# EAGLE schematic RK05ex6x10 (EAGLE 6.6.0)

## Sheet 1 of 5
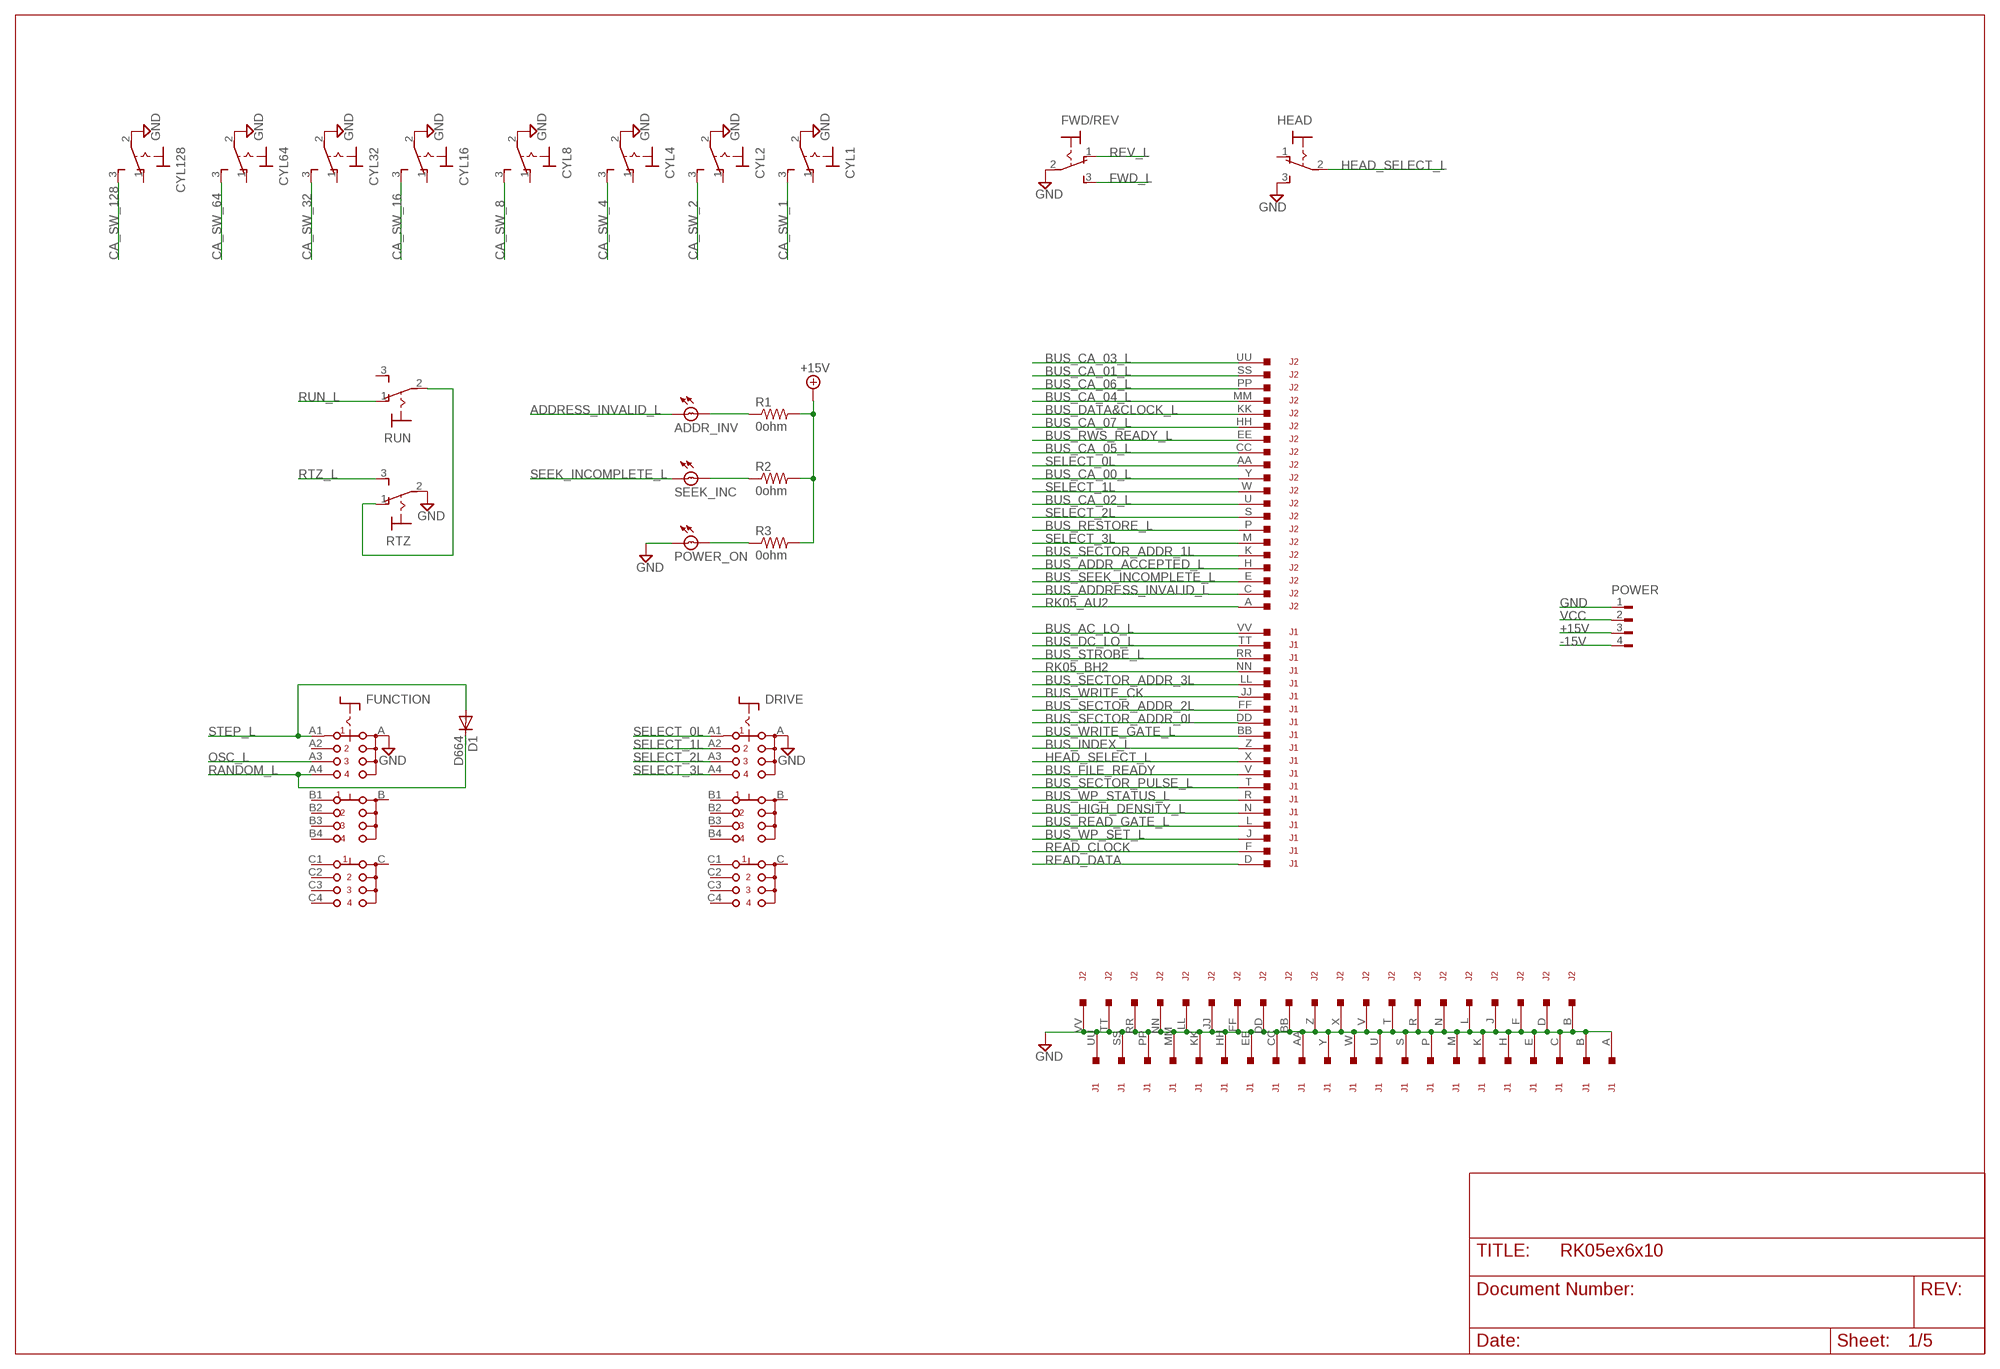
[diagram p0: schematic, sheet 1]

### Parts
ADDR_INV  BULB  [BULB]
CYL1  M9040P  [M9040P]
CYL2  M9040P  [M9040P]
CYL4  M9040P  [M9040P]
CYL8  M9040P  [M9040P]
CYL16  M9040P  [M9040P]
CYL32  M9040P  [M9040P]
CYL64  M9040P  [M9040P]
CYL128  M9040P  [M9040P]
D1  D664  1N4148DO35-10  [DO35-10]
DRIVE  CK103X04  [CK103X04]
FUNCTION  CK103X04  [CK103X04]
FWD/REV  M9040P  [M9040P]
HEAD  M9040P  [M9040P]
J1  DEC40PINSV  [DEC40PINV]
J2  DEC40PINSV  [DEC40PINV]
POWER  FLOPPY-4  [FLOPPY-4]
POWER_ON  BULB  [BULB]
R1  0ohm  R-US_0207/10  [0207/10]
R2  0ohm  R-US_0207/10  [0207/10]
R3  0ohm  R-US_0207/10  [0207/10]
RTZ  M9040P  [M9040P]
RUN  M9040P  [M9040P]
SEEK_INC  BULB  [BULB]

### Nets
+15V: POWER.3 R1.2 R2.2 R3.2 ; also sheet 3
-15V: POWER.4 ; also sheet 3
ADDRESS_INVALID_L: ADDR_INV.B ; also sheet 3
BUS_AC_LO_L: J1.VV ; also sheet 5
BUS_ADDR_ACCEPTED_L: J2.H ; also sheet 5
BUS_ADDRESS_INVALID_L: J2.C ; also sheet 3,5
BUS_CA_00_L: J2.Y ; also sheet 4,5
BUS_CA_01_L: J2.SS ; also sheet 4,5
BUS_CA_02_L: J2.U ; also sheet 4,5
BUS_CA_03_L: J2.UU ; also sheet 4,5
BUS_CA_04_L: J2.MM ; also sheet 4,5
BUS_CA_05_L: J2.CC ; also sheet 4,5
BUS_CA_06_L: J2.PP ; also sheet 4,5
BUS_CA_07_L: J2.HH ; also sheet 4,5
BUS_DATA&CLOCK_L: J2.KK ; also sheet 2,5
BUS_DC_LO_L: J1.TT ; also sheet 5
BUS_FILE_READY: J1.V ; also sheet 5
BUS_HIGH_DENSITY_L: J1.N ; also sheet 5
BUS_INDEX_L: J1.Z ; also sheet 2,5
BUS_READ_GATE_L: J1.L ; also sheet 5
BUS_RESTORE_L: J2.P ; also sheet 3,5
BUS_RWS_READY_L: J2.EE ; also sheet 3,5
BUS_SECTOR_ADDR_0L: J1.DD ; also sheet 2,5
BUS_SECTOR_ADDR_1L: J2.K ; also sheet 2,5
BUS_SECTOR_ADDR_2L: J1.FF ; also sheet 2,5
BUS_SECTOR_ADDR_3L: J1.LL ; also sheet 2,5
BUS_SECTOR_PULSE_L: J1.T ; also sheet 5
BUS_SEEK_INCOMPLETE_L: J2.E ; also sheet 3,5
BUS_STROBE_L: J1.RR ; also sheet 3,5
BUS_WP_SET_L: J1.J ; also sheet 5
BUS_WP_STATUS_L: J1.R ; also sheet 5
BUS_WRITE_CK: J1.JJ ; also sheet 5
BUS_WRITE_GATE_L: J1.BB ; also sheet 2,5
CA_SW_1: CYL1.3(S) ; also sheet 4
CA_SW_2: CYL2.3(S) ; also sheet 4
CA_SW_4: CYL4.3(S) ; also sheet 4
CA_SW_8: CYL8.3(S) ; also sheet 4
CA_SW_16: CYL16.3(S) ; also sheet 4
CA_SW_32: CYL32.3(S) ; also sheet 4
CA_SW_64: CYL64.3(S) ; also sheet 4
CA_SW_128: CYL128.3(S) ; also sheet 4
FWD_L: FWD/REV.3(S) ; also sheet 3
GND: CYL1.2(P) CYL2.2(P) CYL4.2(P) CYL8.2(P) CYL16.2(P) CYL32.2(P) CYL64.2(P) CYL128.2(P) DRIVE.A FUNCTION.A FWD/REV.2(P) HEAD.3(S) J1.A J1.AA J1.B J1.C J1.CC J1.E J1.EE J1.H J1.HH J1.K J1.KK J1.M J1.MM J1.P J1.PP J1.S J1.SS J1.U J1.UU J1.W J1.Y J2.B J2.BB J2.D J2.DD J2.F J2.FF J2.J J2.JJ J2.L J2.LL J2.N J2.NN J2.R J2.RR J2.T J2.TT J2.V J2.VV J2.X J2.Z POWER.1 POWER_ON.B RTZ.2(P) ; also sheet 2,3,4,5
HEAD_SELECT_L: HEAD.2(P) J1.X ; also sheet 5
N$30: RTZ.1(O) RUN.2(P)
N$37: ADDR_INV.A R1.1
N$38: R2.1 SEEK_INC.A
N$39: POWER_ON.A R3.1
OSC_L: FUNCTION.A3 ; also sheet 3
RANDOM_L: D1.C FUNCTION.A4 ; also sheet 3
READ_CLOCK: J1.F ; also sheet 5
READ_DATA: J1.D ; also sheet 5
REV_L: FWD/REV.1(O) ; also sheet 3
RK05_AU2: J2.A ; also sheet 5
RK05_BH2: J1.NN ; also sheet 5
RTZ_L: RTZ.3(S) ; also sheet 3
RUN_L: RUN.1(O) ; also sheet 3
SEEK_INCOMPLETE_L: SEEK_INC.B ; also sheet 3
SELECT_0L: DRIVE.A1 J2.AA ; also sheet 5
SELECT_1L: DRIVE.A2 J2.W ; also sheet 5
SELECT_2L: DRIVE.A3 J2.S ; also sheet 5
SELECT_3L: DRIVE.A4 J2.M ; also sheet 5
STEP_L: D1.A FUNCTION.A1 ; also sheet 3
VCC: POWER.2 ; also sheet 2,3,4,5
Unconnected: CYL1.1(O) CYL2.1(O) CYL4.1(O) CYL8.1(O) CYL16.1(O) CYL32.1(O) CYL64.1(O) CYL128.1(O) DRIVE.B DRIVE.B1 DRIVE.B2 DRIVE.B3 DRIVE.B4 DRIVE.C DRIVE.C1 DRIVE.C2 DRIVE.C3 DRIVE.C4 FUNCTION.A2 FUNCTION.B FUNCTION.B1 FUNCTION.B2 FUNCTION.B3 FUNCTION.B4 FUNCTION.C FUNCTION.C1 FUNCTION.C2 FUNCTION.C3 FUNCTION.C4 HEAD.1(O) RUN.3(S)

## Sheet 2 of 5
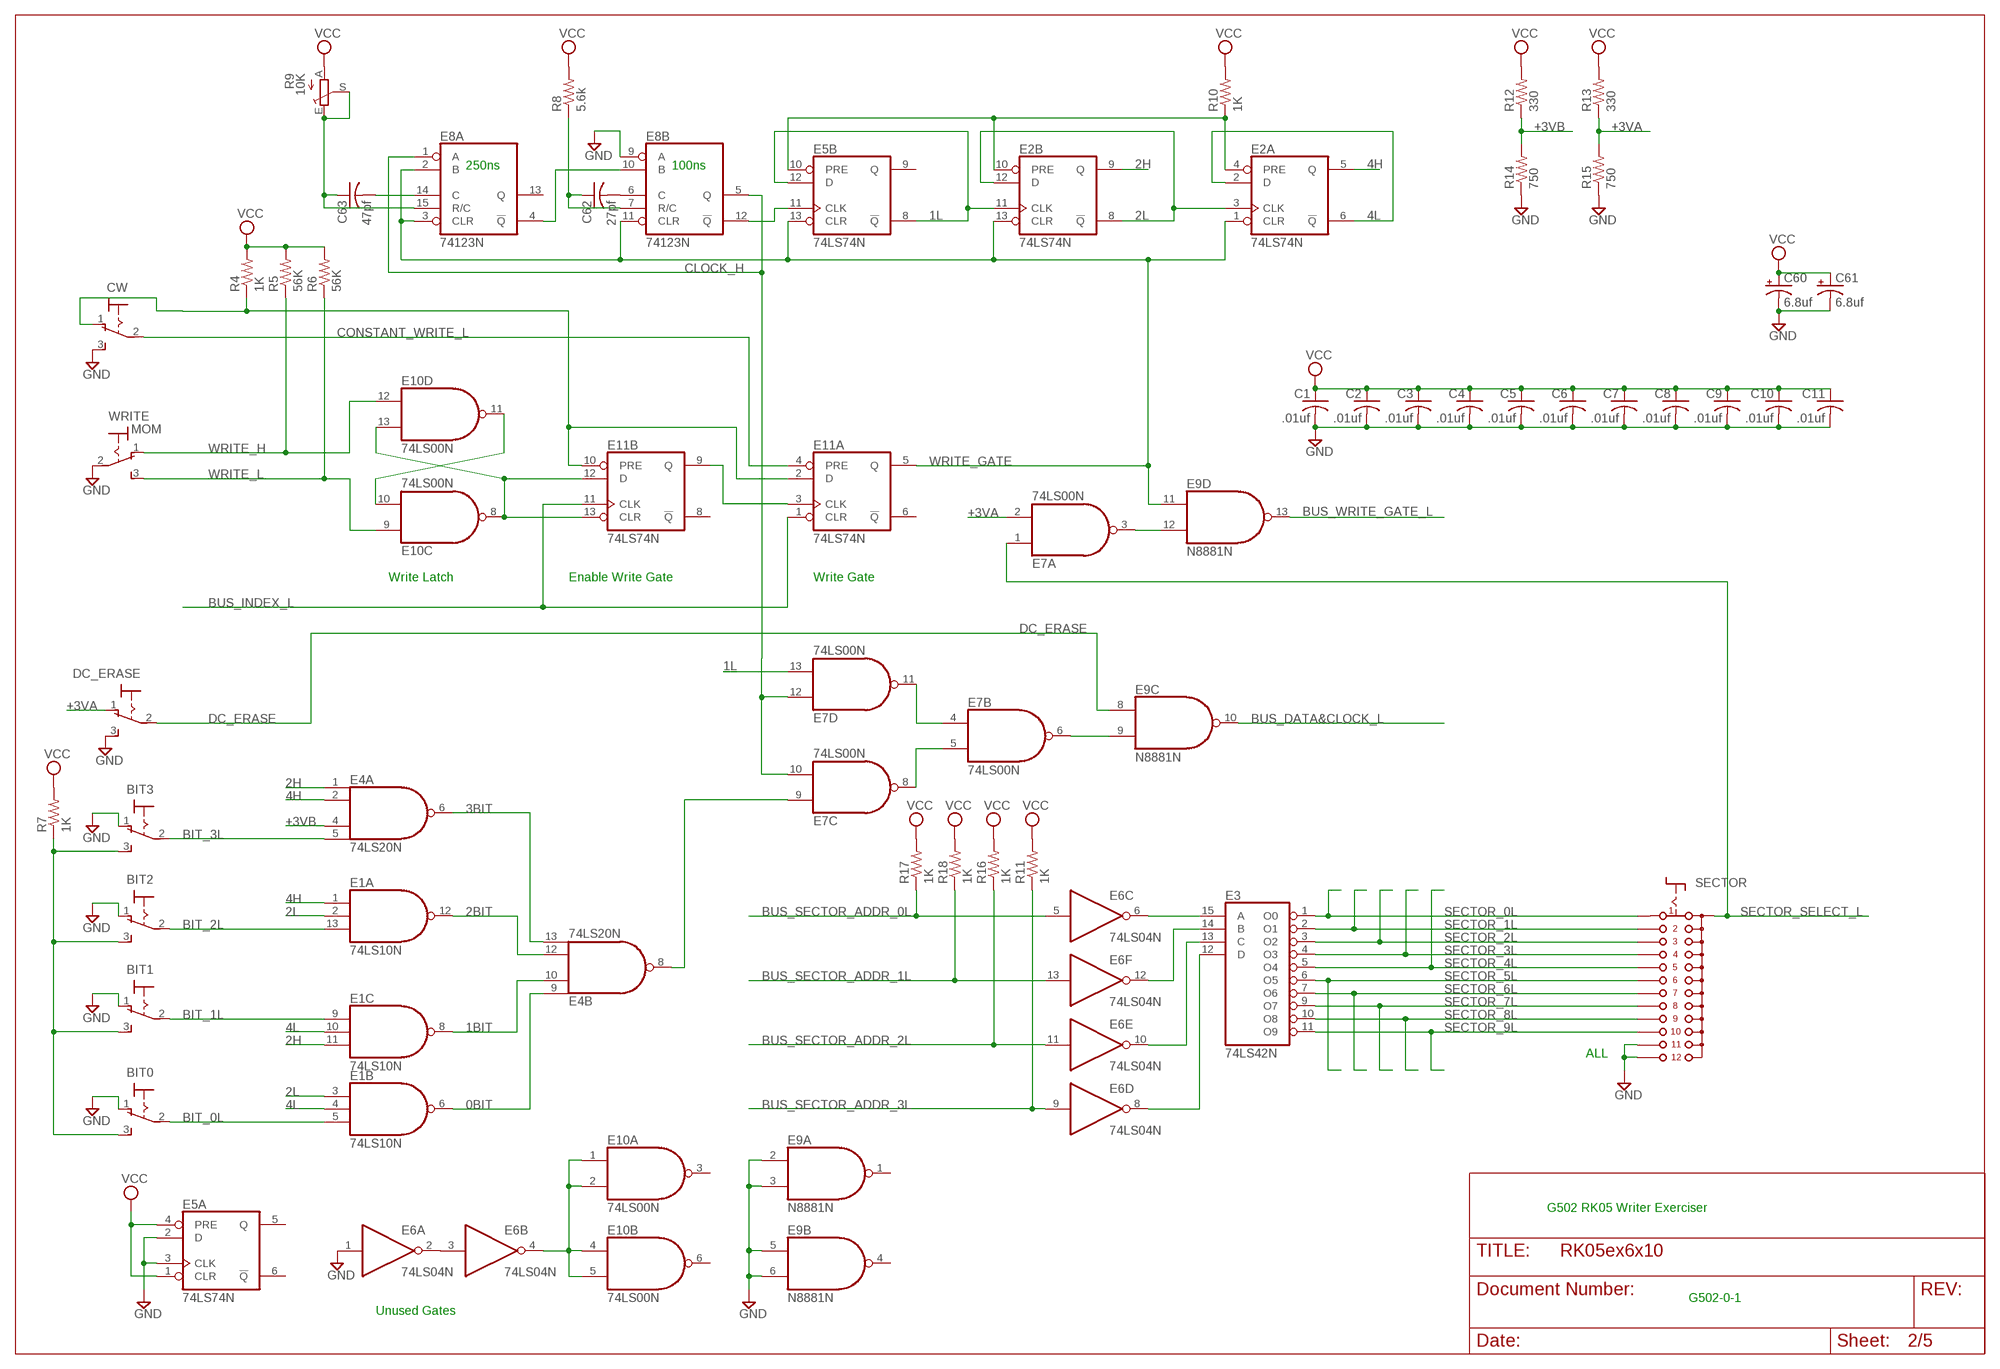
[diagram p1: schematic, sheet 2]

### Parts
BIT0  M9040P  [M9040P]
BIT1  M9040P  [M9040P]
BIT2  M9040P  [M9040P]
BIT3  M9040P  [M9040P]
C1  .01uf  C-US075-032X103  [C075-032X103]
C2  .01uf  C-US075-032X103  [C075-032X103]
C3  .01uf  C-US075-032X103  [C075-032X103]
C4  .01uf  C-US075-032X103  [C075-032X103]
C5  .01uf  C-US075-032X103  [C075-032X103]
C6  .01uf  C-US075-032X103  [C075-032X103]
C7  .01uf  C-US075-032X103  [C075-032X103]
C8  .01uf  C-US075-032X103  [C075-032X103]
C9  .01uf  C-US075-032X103  [C075-032X103]
C10  .01uf  C-US075-032X103  [C075-032X103]
C11  .01uf  C-US075-032X103  [C075-032X103]
C60  6.8uf  CPOL-USE15-5AXIAL  [E15-5]
C61  6.8uf  CPOL-USE15-5AXIAL  [E15-5]
C62  27pf  C-US075-032X103  [C075-032X103]
C63  47pf  C-US075-032X103  [C075-032X103]
CW  M9040P  [M9040P]
DC_ERASE  M9040P  [M9040P]
E1  74LS10N  [DIL14]
E2  74LS74N  [DIL14]
E3  74LS42N  [DIL16]
E4  74LS20N  [DIL14]
E5  74LS74N  [DIL14]
E6  74LS04N  [DIL14]
E7  74LS00N  [DIL14]
E8  74123N  74LS123N  [DIL16]
E9  N8881N  [DIL14]
E10  74LS00N  [DIL14]
E11  74LS74N  [DIL14]
R4  1K  R-US_0207/10  [0207/10]
R5  56K  R-US_0207/10  [0207/10]
R6  56K  R-US_0207/10  [0207/10]
R7  1K  R-US_0207/10  [0207/10]
R8  5.6k  R-US_0207/10  [0207/10]
R9  10K  TRIM_EU-B90P  [SP19L]
R10  1K  R-US_0207/10  [0207/10]
R11  1K  R-US_0207/10  [0207/10]
R12  330  R-US_0207/10  [0207/10]
R13  330  R-US_0207/10  [0207/10]
R14  750  R-US_0207/10  [0207/10]
R15  750  R-US_0207/10  [0207/10]
R16  1K  R-US_0207/10  [0207/10]
R17  1K  R-US_0207/10  [0207/10]
R18  1K  R-US_0207/10  [0207/10]
SECTOR  CK101X12  [CK101X12]
WRITE  MOM  M9040P  [M9040P]

### Nets
0BIT: E1.6(B:O) E4.9(B:I0)
1.44MHZ: E5.11(B:CLK) E8.12(B:!Q)
1BIT: E1.8(C:O) E4.10(B:I1)
1L: E2.11(B:CLK) E5.8(B:!Q) E5.12(B:D) E7.13(D:I1)
2.88MHZ: E8.4(A:!Q) E8.10(B:B)
2BIT: E1.12(A:O) E4.12(B:I2)
2H: E1.11(C:I2) E2.9(B:Q) E4.1(A:I0)
2L: E1.2(A:I1) E1.3(B:I0) E2.3(A:CLK) E2.8(B:!Q) E2.12(B:D)
3BIT: E4.6(A:O) E4.13(B:I3)
4H: E1.1(A:I0) E2.5(A:Q) E4.2(A:I1)
4L: E1.4(B:I1) E1.10(C:I1) E2.2(A:D) E2.6(A:!Q)
+3VA: DC_ERASE.1(O) E7.2(A:I1) R13.1 R15.2
+3VB: E4.4(A:I2) R12.1 R14.2
+3VC: CW.1(O) E11.2(A:D) E11.10(B:PRE) R4.1
BIT_0L: BIT0.2(P) E1.5(B:I2)
BIT_1L: BIT1.2(P) E1.9(C:I0)
BIT_2L: BIT2.2(P) E1.13(A:I2)
BIT_3L: BIT3.2(P) E4.5(A:I3)
BUS_DATA&CLOCK_L: E9.10(C:O) ; also sheet 1,5
BUS_INDEX_L: E11.1(A:CLR) E11.11(B:CLK) ; also sheet 1,5
BUS_SECTOR_ADDR_0L: E6.5(C:I) R17.1 ; also sheet 1,5
BUS_SECTOR_ADDR_1L: E6.13(F:I) R18.1 ; also sheet 1,5
BUS_SECTOR_ADDR_2L: E6.11(E:I) R16.1 ; also sheet 1,5
BUS_SECTOR_ADDR_3L: E6.9(D:I) R11.1 ; also sheet 1,5
BUS_WRITE_GATE_L: E9.13(D:O) ; also sheet 1,5
CLOCK_H: E7.10(C:I1) E7.12(D:I0) E8.1(A:A) E8.5(B:Q)
CONSTANT_WRITE_L: CW.2(P) E11.4(A:PRE)
DATA_BITS: BIT0.3(S) BIT1.3(S) BIT2.3(S) BIT3.3(S) R7.1
DC_ERASE: DC_ERASE.2(P) E9.8(C:I0)
GND: BIT0.1(O) BIT1.1(O) BIT2.1(O) BIT3.1(O) C1.2 C2.2 C3.2 C4.2 C5.2 C6.2 C7.2 C8.2 C9.2 C10.2 C11.2 C60.- C61.- CW.3(S) DC_ERASE.3(S) E5.2(A:D) E5.3(A:CLK) E6.1(A:I) E8.9(B:A) E9.2(A:I0) E9.3(A:I1) E9.5(B:I0) E9.6(B:I1) R14.1 R15.1 SECTOR.11 SECTOR.12 WRITE.2(P) ; also sheet 1,3,4,5
N$2: E7.6(B:O) E9.9(C:I1)
N$3: E10.8(C:O) E10.13(D:I1) E11.12(B:D) E11.13(B:CLR)
N$4: E10.10(C:I1) E10.11(D:O)
N$5: E2.4(A:PRE) E2.10(B:PRE) E5.10(B:PRE) R10.1
N$6: E7.4(B:I0) E7.11(D:O)
N$7: E7.5(B:I1) E7.8(C:O)
N$8: E11.3(A:CLK) E11.9(B:Q)
N$9: E4.8(B:O) E7.9(C:I0)
N$11: C63.2 E8.14(A:C)
N$12: C62.2 E8.6(B:C)
N$13: C63.1 E8.15(A:R/C) R9.E R9.S
N$14: C62.1 E8.7(B:R/C) R8.1
N$15: E7.3(A:O) E9.12(D:I1)
N$29: E3.15(A) E6.6(C:O)
N$31: E3.14(B) E6.12(F:O)
N$32: E3.13(C) E6.10(E:O)
N$33: E3.12(D) E6.8(D:O)
N$34: E6.2(A:O) E6.3(B:I)
N$36: E6.4(B:O) E10.1(A:I0) E10.2(A:I1) E10.4(B:I0) E10.5(B:I1)
SECTOR_0L: E3.1(O0) SECTOR.1
SECTOR_1L: E3.2(O1) SECTOR.2
SECTOR_2L: E3.3(O2) SECTOR.3
SECTOR_3L: E3.4(O3) SECTOR.4
SECTOR_4L: E3.5(O4) SECTOR.5
SECTOR_5L: E3.6(O5) SECTOR.6
SECTOR_6L: E3.7(O6) SECTOR.7
SECTOR_7L: E3.9(O7) SECTOR.8
SECTOR_8L: E3.10(O8) SECTOR.9
SECTOR_9L: E3.11(O9) SECTOR.10
SECTOR_SELECT_L: E7.1(A:I0) SECTOR.A
VCC: C1.1 C2.1 C3.1 C4.1 C5.1 C6.1 C7.1 C8.1 C9.1 C10.1 C11.1 C60.+ C61.+ E5.1(A:CLR) E5.4(A:PRE) R4.2 R5.2 R6.2 R7.2 R8.2 R9.A R10.2 R11.2 R12.2 R13.2 R16.2 R17.2 R18.2 ; also sheet 1,3,4,5
WRITE_GATE: E2.1(A:CLR) E2.13(B:CLR) E5.13(B:CLR) E8.2(A:B) E8.3(A:CLR) E8.11(B:CLR) E9.11(D:I0) E11.5(A:Q)
WRITE_H: E10.12(D:I0) R5.1 WRITE.1(O)
WRITE_L: E10.9(C:I0) R6.1 WRITE.3(S)
Unconnected: E5.5(A:Q) E5.6(A:!Q) E5.9(B:Q) E8.13(A:Q) E9.1(A:O) E9.4(B:O) E10.3(A:O) E10.6(B:O) E11.6(A:!Q) E11.8(B:!Q)

### Notes on the sheet
- 250ns | 100ns
- Write Latch | Enable Write Gate | Write Gate
- ALL
- G502 RK05 Writer Exerciser
- G502-0-1
- Unused Gates

## Sheet 3 of 5
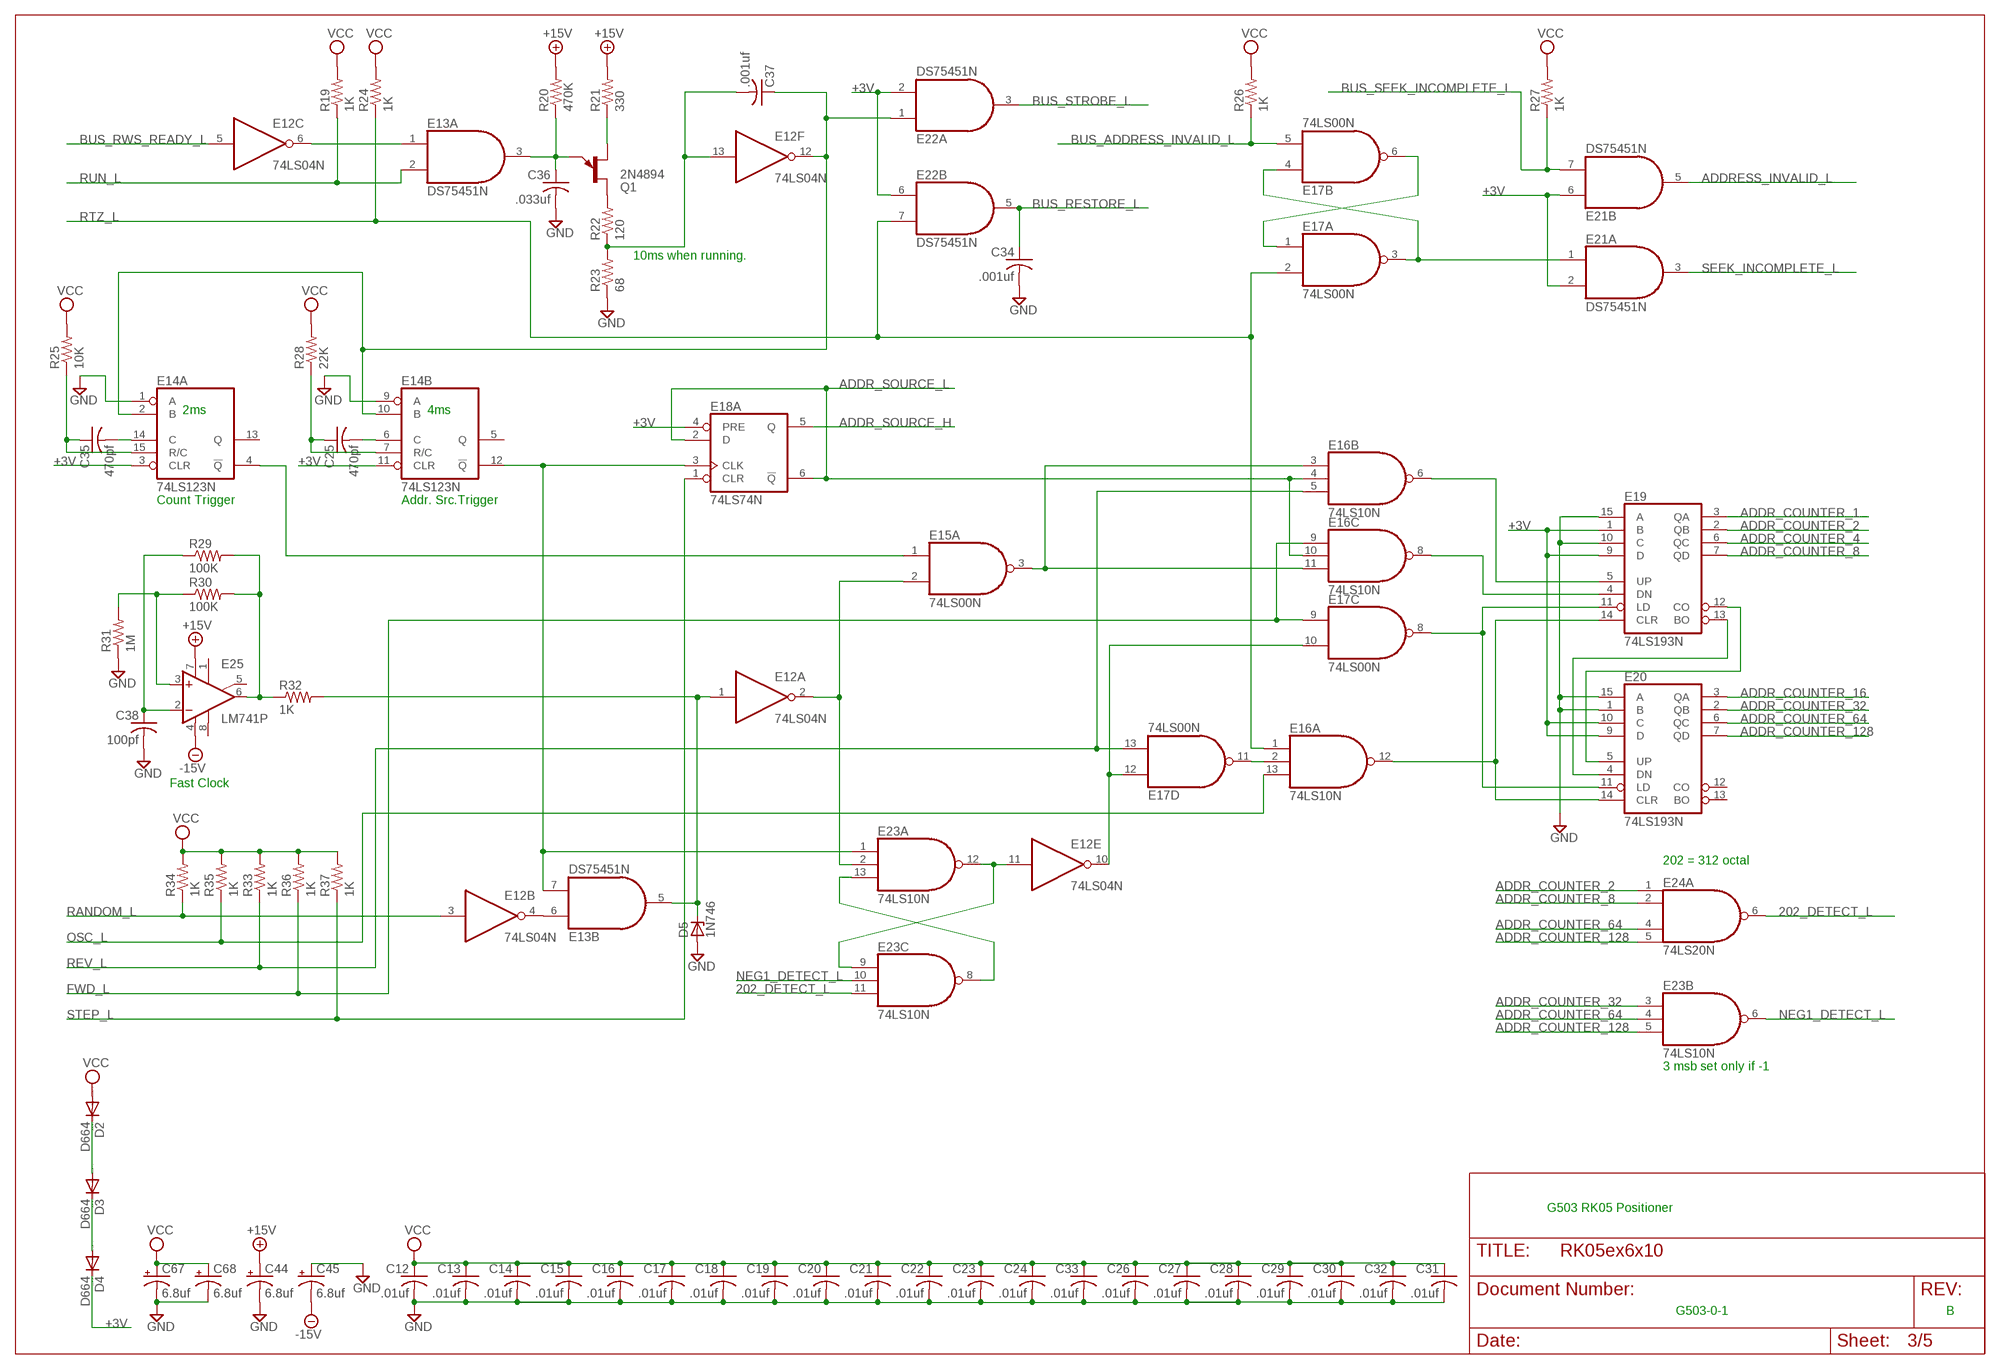
[diagram p2: schematic, sheet 3]

### Parts
C12  .01uf  C-US075-032X103  [C075-032X103]
C13  .01uf  C-US075-032X103  [C075-032X103]
C14  .01uf  C-US075-032X103  [C075-032X103]
C15  .01uf  C-US075-032X103  [C075-032X103]
C16  .01uf  C-US075-032X103  [C075-032X103]
C17  .01uf  C-US075-032X103  [C075-032X103]
C18  .01uf  C-US075-032X103  [C075-032X103]
C19  .01uf  C-US075-032X103  [C075-032X103]
C20  .01uf  C-US075-032X103  [C075-032X103]
C21  .01uf  C-US075-032X103  [C075-032X103]
C22  .01uf  C-US075-032X103  [C075-032X103]
C23  .01uf  C-US075-032X103  [C075-032X103]
C24  .01uf  C-US075-032X103  [C075-032X103]
C25  470pf  C-US075-032X103  [C075-032X103]
C26  .01uf  C-US075-032X103  [C075-032X103]
C27  .01uf  C-US075-032X103  [C075-032X103]
C28  .01uf  C-US075-032X103  [C075-032X103]
C29  .01uf  C-US075-032X103  [C075-032X103]
C30  .01uf  C-US075-032X103  [C075-032X103]
C31  .01uf  C-US075-032X103  [C075-032X103]
C32  .01uf  C-US075-032X103  [C075-032X103]
C33  .01uf  C-US075-032X103  [C075-032X103]
C34  .001uf  C-US075-032X103  [C075-032X103]
C35  470pf  C-US075-032X103  [C075-032X103]
C36  .033uf  C-US075-032X103  [C075-032X103]
C37  .001uf  C-US075-032X103  [C075-032X103]
C38  100pf  C-US075-032X103  [C075-032X103]
C44  6.8uf  CPOL-USE15-5AXIAL  [E15-5]
C45  6.8uf  CPOL-USE15-5AXIAL  [E15-5]
C67  6.8uf  CPOL-USE15-5AXIAL  [E15-5]
C68  6.8uf  CPOL-USE15-5AXIAL  [E15-5]
D2  D664  1N4148DO35-10  [DO35-10]
D3  D664  1N4148DO35-10  [DO35-10]
D4  D664  1N4148DO35-10  [DO35-10]
D5  1N746  ZENER-DIODEDO35Z10  [DO35Z10]
E12  74LS04N  [DIL14]
E13  DS75451N  [DIL08]
E14  74LS123N  [DIL16]
E15  74LS00N  [DIL14]
E16  74LS10N  74AS10N  [DIL14]
E17  74LS00N  [DIL14]
E18  74LS74N  [DIL14]
E19  74LS193N  [DIL16]
E20  74LS193N  [DIL16]
E21  DS75451N  [DIL08]
E22  DS75451N  [DIL08]
E23  74LS10N  74AS10N  [DIL14]
E24  74LS20N  [DIL14]
E25  LM741P  [DIL08]
Q1  2N4894  2N4870  [TO92E]
R19  1K  R-US_0207/10  [0207/10]
R20  470K  R-US_0207/10  [0207/10]
R21  330  R-US_0207/10  [0207/10]
R22  120  R-US_0207/10  [0207/10]
R23  68  R-US_0207/10  [0207/10]
R24  1K  R-US_0207/10  [0207/10]
R25  10K  R-US_0207/10  [0207/10]
R26  1K  R-US_0207/10  [0207/10]
R27  1K  R-US_0207/10  [0207/10]
R28  22K  R-US_0207/10  [0207/10]
R29  100K  R-US_0207/10  [0207/10]
R30  100K  R-US_0207/10  [0207/10]
R31  1M  R-US_0207/10  [0207/10]
R32  1K  R-US_0207/10  [0207/10]
R33  1K  R-US_0207/10  [0207/10]
R34  1K  R-US_0207/10  [0207/10]
R35  1K  R-US_0207/10  [0207/10]
R36  1K  R-US_0207/10  [0207/10]
R37  1K  R-US_0207/10  [0207/10]

### Nets
202_DETECT_L: E23.11(C:I2) E24.6(A:O)
+3V: D4.C E14.3(A:CLR) E14.11(B:CLR) E18.4(A:PRE) E19.1(B) E19.9(D) E20.9(D) E20.10(C) E21.2(A:I1) E21.6(B:I0) E22.2(A:I1) E22.6(B:I0)
+15V: C44.+ E25.7(V+) R20.2 R21.2 ; also sheet 1
-15V: C45.- E25.4(V-) ; also sheet 1
ADDR_COUNTER_1: E19.3(QA) ; also sheet 4
ADDR_COUNTER_2: E19.2(QB) E24.1(A:I0) ; also sheet 4
ADDR_COUNTER_4: E19.6(QC) ; also sheet 4
ADDR_COUNTER_8: E19.7(QD) E24.2(A:I1) ; also sheet 4
ADDR_COUNTER_16: E20.3(QA) ; also sheet 4
ADDR_COUNTER_32: E20.2(QB) E23.3(B:I0) ; also sheet 4
ADDR_COUNTER_64: E20.6(QC) E23.4(B:I1) E24.4(A:I2) ; also sheet 4
ADDR_COUNTER_128: E20.7(QD) E23.5(B:I2) E24.5(A:I3) ; also sheet 4
ADDR_SOURCE_H: E18.5(A:Q) ; also sheet 4
ADDR_SOURCE_L: E16.4(B:I1) E16.10(C:I1) E18.2(A:D) E18.6(A:!Q) ; also sheet 4
ADDRESS_INVALID_L: E21.5(B:O) ; also sheet 1
BUS_ADDRESS_INVALID_L: E17.5(B:I1) R26.1 ; also sheet 1,5
BUS_RESTORE_L: C34.1 E22.5(B:O) ; also sheet 1,5
BUS_RWS_READY_L: E12.5(C:I) ; also sheet 1,5
BUS_SEEK_INCOMPLETE_L: E21.7(B:I1) R27.1 ; also sheet 1,5
BUS_STROBE_L: E22.3(A:O) ; also sheet 1,5
FWD_L: E16.9(C:I0) E17.9(C:I0) R36.1 ; also sheet 1
GND: C12.2 C13.2 C14.2 C15.2 C16.2 C17.2 C18.2 C19.2 C20.2 C21.2 C22.2 C23.2 C24.2 C26.2 C27.2 C28.2 C29.2 C30.2 C31.2 C32.2 C33.2 C34.2 C36.2 C38.2 C44.- C45.+ C67.- C68.- D5.A E14.1(A:A) E14.9(B:A) E19.10(C) E19.15(A) E20.1(B) E20.15(A) R23.1 R31.1 ; also sheet 1,2,4,5
N$1: E12.6(C:O) E13.1(A:I0)
N$10: C36.1 E13.3(A:O) Q1.E R20.1
N$16: Q1.B1 R21.1
N$17: Q1.B2 R22.2
N$18: C37.2 E12.13(F:I) R22.1 R23.2
N$19: C37.1 E12.12(F:O) E14.2(A:B) E14.10(B:B) E22.1(A:I0)
N$20: E17.1(A:I0) E17.6(B:O)
N$21: E17.3(A:O) E17.4(B:I0) E21.1(A:I0)
N$22: C35.1 E14.15(A:R/C) R25.1
N$23: C35.2 E14.14(A:C)
N$24: C25.1 E14.7(B:R/C) R28.1
N$25: C25.2 E14.6(B:C)
N$26: E19.13(BO) E20.4(DN)
N$27: E19.12(CO) E20.5(UP)
N$28: E16.6(B:O) E19.5(UP)
N$35: E16.8(C:O) E19.4(DN)
N$40: E17.8(C:O) E19.11(LD) E20.11(LD)
N$41: E16.12(A:O) E19.14(CLR) E20.14(CLR)
N$42: C38.1 E25.2(-IN) R29.1
N$43: E25.6(OUT) R29.2 R30.2 R32.1
N$44: E25.3(+IN) R30.1 R31.2
N$46: E12.2(A:O) E15.2(A:I1) E23.2(A:I1)
N$47: E14.4(A:!Q) E15.1(A:I0)
N$48: D2.C D3.A
N$53: D3.C D4.A
N$55: E12.4(B:O) E13.6(B:I0)
N$57: E13.7(B:I1) E14.12(B:!Q) E18.3(A:CLK) E23.1(A:I0)
N$58: D5.C E12.1(A:I) E13.5(B:O) R32.2
N$59: E15.3(A:O) E16.3(B:I0) E16.11(C:I2)
N$60: E23.8(C:O) E23.13(A:I2)
N$61: E12.11(E:I) E23.9(C:I0) E23.12(A:O)
N$62: E16.2(A:I1) E17.11(D:O)
N$63: E12.10(E:O) E17.10(C:I1) E17.12(D:I0)
NEG1_DETECT_L: E23.6(B:O) E23.10(C:I1)
OSC_L: E16.13(A:I2) R35.1 ; also sheet 1
RANDOM_L: E12.3(B:I) R34.1 ; also sheet 1
REV_L: E16.5(B:I2) E17.13(D:I1) R33.1 ; also sheet 1
RTZ_L: E16.1(A:I0) E17.2(A:I1) E22.7(B:I1) R24.1 ; also sheet 1
RUN_L: E13.2(A:I1) R19.1 ; also sheet 1
SEEK_INCOMPLETE_L: E21.3(A:O) ; also sheet 1
STEP_L: E18.1(A:CLR) R37.1 ; also sheet 1
VCC: C12.1 C13.1 C14.1 C15.1 C16.1 C17.1 C18.1 C19.1 C20.1 C21.1 C22.1 C23.1 C24.1 C26.1 C27.1 C28.1 C29.1 C30.1 C31.1 C32.1 C33.1 C67.+ C68.+ D2.A R19.2 R24.2 R25.2 R26.2 R27.2 R28.2 R33.2 R34.2 R35.2 R36.2 R37.2 ; also sheet 1,2,4,5
Unconnected: E14.5(B:Q) E14.13(A:Q) E20.12(CO) E20.13(BO) E25.1(ON1) E25.5(ON2) E25.8(OPT)

### Notes on the sheet
- 10ms when running.
- 2ms | 4ms
- Count Trigger | Addr. Src.Trigger
- Fast Clock
- 202 = 312 octal
- 3 msb set only if -1
- G503 RK05 Positioner
- G503-0-1 | B

## Sheet 4 of 5
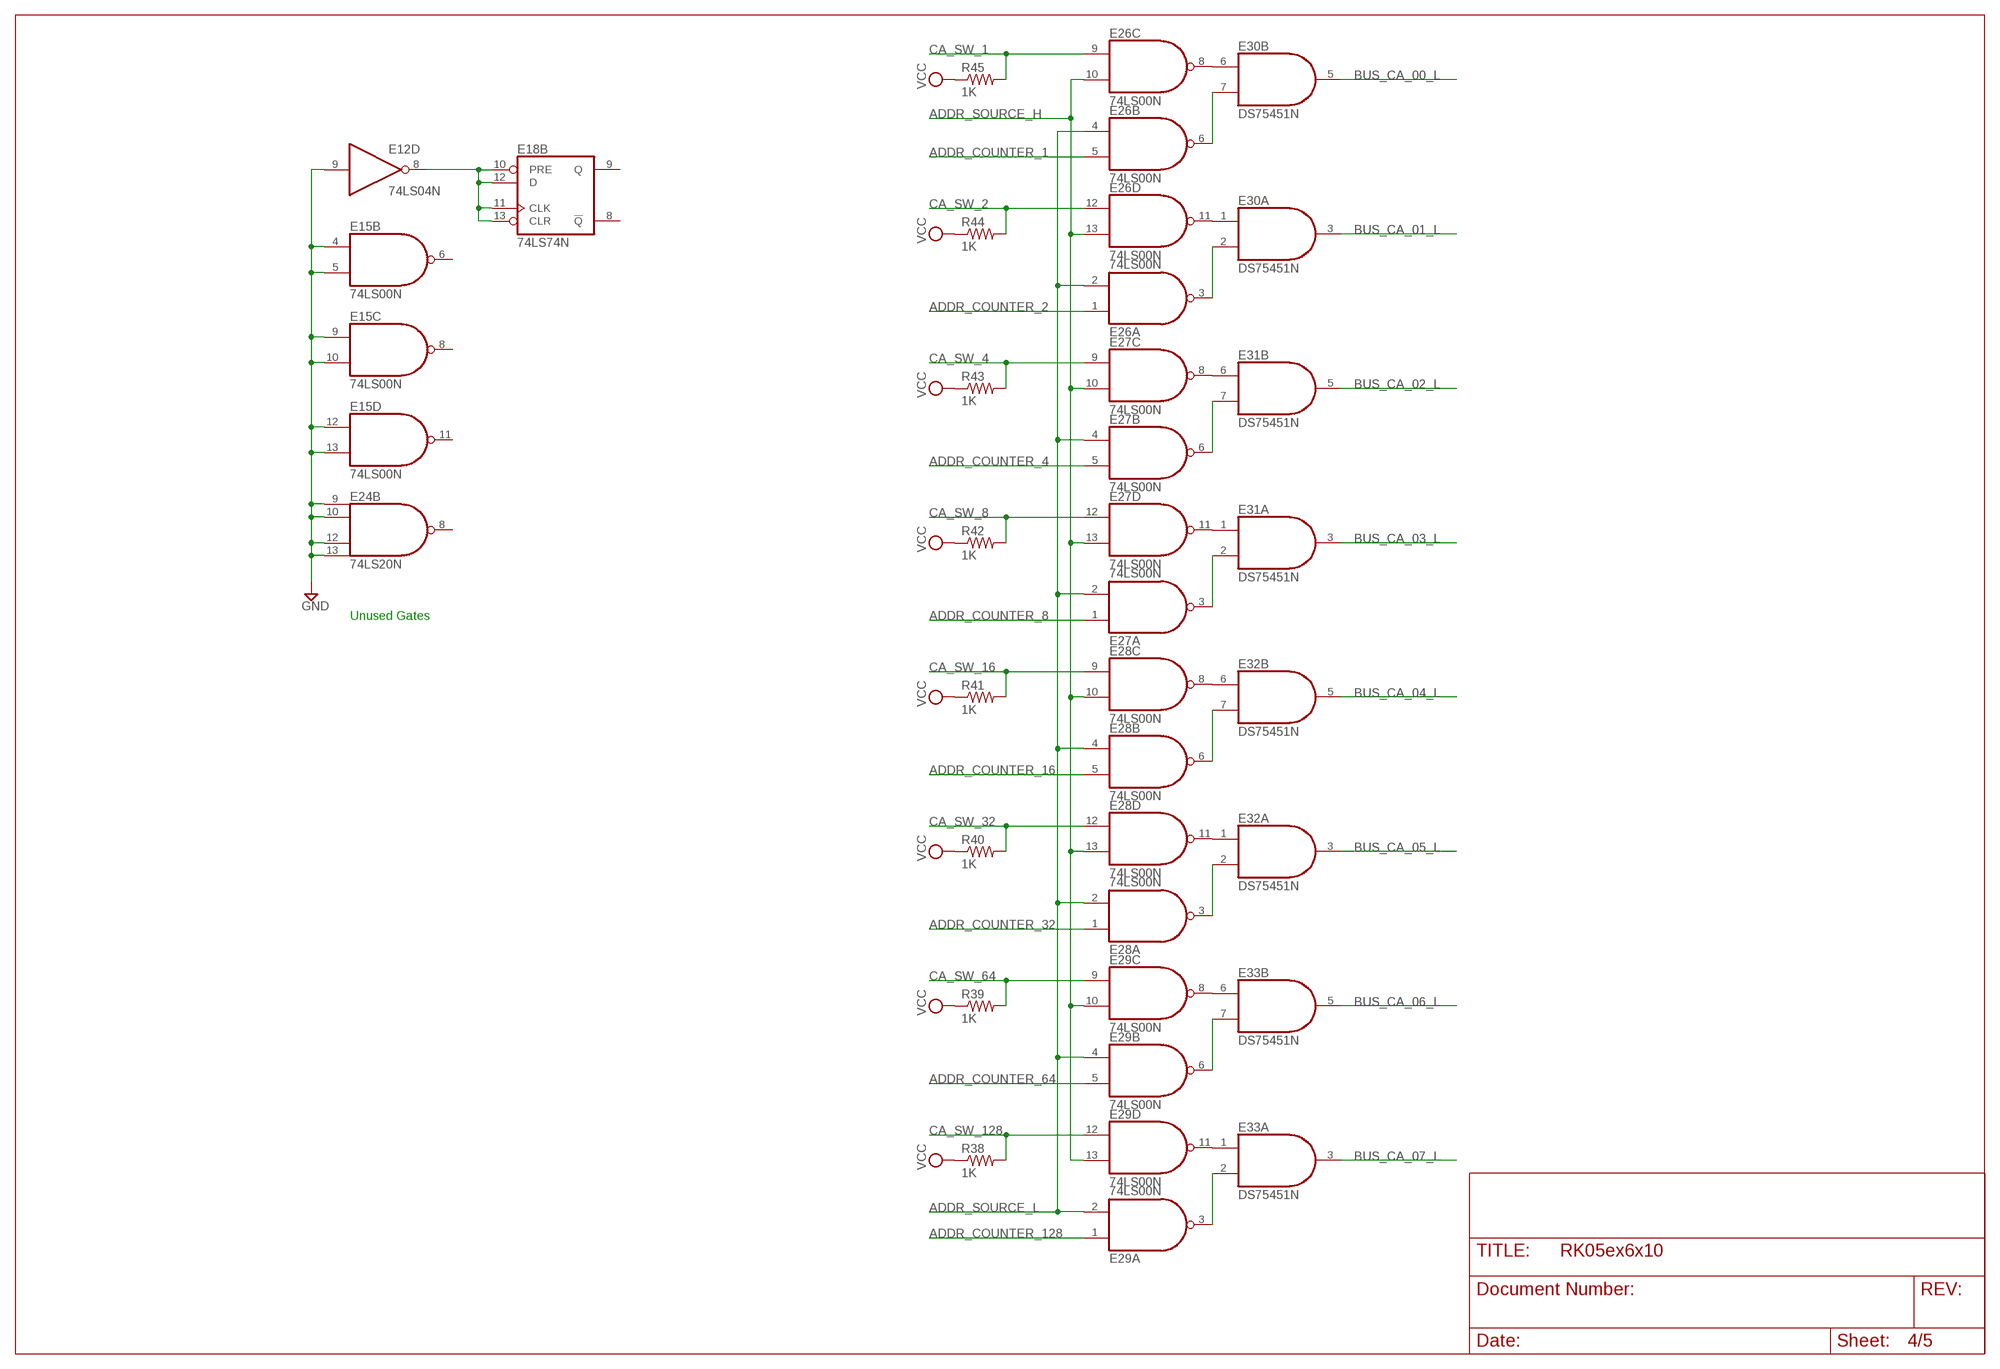
[diagram p3: schematic, sheet 4]

### Parts
E26  74LS00N  [DIL14]
E27  74LS00N  [DIL14]
E28  74LS00N  [DIL14]
E29  74LS00N  [DIL14]
E30  DS75451N  [DIL08]
E31  DS75451N  [DIL08]
E32  DS75451N  [DIL08]
E33  DS75451N  [DIL08]
R38  1K  R-US_0207/10  [0207/10]
R39  1K  R-US_0207/10  [0207/10]
R40  1K  R-US_0207/10  [0207/10]
R41  1K  R-US_0207/10  [0207/10]
R42  1K  R-US_0207/10  [0207/10]
R43  1K  R-US_0207/10  [0207/10]
R44  1K  R-US_0207/10  [0207/10]
R45  1K  R-US_0207/10  [0207/10]

### Nets
ADDR_COUNTER_1: E26.5(B:I1) ; also sheet 3
ADDR_COUNTER_2: E26.1(A:I0) ; also sheet 3
ADDR_COUNTER_4: E27.5(B:I1) ; also sheet 3
ADDR_COUNTER_8: E27.1(A:I0) ; also sheet 3
ADDR_COUNTER_16: E28.5(B:I1) ; also sheet 3
ADDR_COUNTER_32: E28.1(A:I0) ; also sheet 3
ADDR_COUNTER_64: E29.5(B:I1) ; also sheet 3
ADDR_COUNTER_128: E29.1(A:I0) ; also sheet 3
ADDR_SOURCE_H: E26.10(C:I1) E26.13(D:I1) E27.10(C:I1) E27.13(D:I1) E28.10(C:I1) E28.13(D:I1) E29.10(C:I1) E29.13(D:I1) ; also sheet 3
ADDR_SOURCE_L: E26.2(A:I1) E26.4(B:I0) E27.2(A:I1) E27.4(B:I0) E28.2(A:I1) E28.4(B:I0) E29.2(A:I1) E29.4(B:I0) ; also sheet 3
BUS_CA_00_L: E30.5(B:O) ; also sheet 1,5
BUS_CA_01_L: E30.3(A:O) ; also sheet 1,5
BUS_CA_02_L: E31.5(B:O) ; also sheet 1,5
BUS_CA_03_L: E31.3(A:O) ; also sheet 1,5
BUS_CA_04_L: E32.5(B:O) ; also sheet 1,5
BUS_CA_05_L: E32.3(A:O) ; also sheet 1,5
BUS_CA_06_L: E33.5(B:O) ; also sheet 1,5
BUS_CA_07_L: E33.3(A:O) ; also sheet 1,5
CA_SW_1: E26.9(C:I0) R45.2 ; also sheet 1
CA_SW_2: E26.12(D:I0) R44.2 ; also sheet 1
CA_SW_4: E27.9(C:I0) R43.2 ; also sheet 1
CA_SW_8: E27.12(D:I0) R42.2 ; also sheet 1
CA_SW_16: E28.9(C:I0) R41.2 ; also sheet 1
CA_SW_32: E28.12(D:I0) R40.2 ; also sheet 1
CA_SW_64: E29.9(C:I0) R39.2 ; also sheet 1
CA_SW_128: E29.12(D:I0) R38.2 ; also sheet 1
GND: E12.9(D:I) E15.4(B:I0) E15.5(B:I1) E15.9(C:I0) E15.10(C:I1) E15.12(D:I0) E15.13(D:I1) E24.9(B:I0) E24.10(B:I1) E24.12(B:I2) E24.13(B:I3) ; also sheet 1,2,3,5
N$64: E26.6(B:O) E30.7(B:I1)
N$65: E26.8(C:O) E30.6(B:I0)
N$66: E26.3(A:O) E30.2(A:I1)
N$67: E26.11(D:O) E30.1(A:I0)
N$68: E27.8(C:O) E31.6(B:I0)
N$69: E27.6(B:O) E31.7(B:I1)
N$70: E27.11(D:O) E31.1(A:I0)
N$71: E27.3(A:O) E31.2(A:I1)
N$72: E28.6(B:O) E32.7(B:I1)
N$73: E28.3(A:O) E32.2(A:I1)
N$75: E29.6(B:O) E33.7(B:I1)
N$76: E29.3(A:O) E33.2(A:I1)
N$77: E29.11(D:O) E33.1(A:I0)
N$78: E29.8(C:O) E33.6(B:I0)
N$80: E28.11(D:O) E32.1(A:I0)
N$81: E28.8(C:O) E32.6(B:I0)
N$82: E12.8(D:O) E18.10(B:PRE) E18.11(B:CLK) E18.12(B:D) E18.13(B:CLR)
VCC: R38.1 R39.1 R40.1 R41.1 R42.1 R43.1 R44.1 R45.1 ; also sheet 1,2,3,5
Unconnected: E15.6(B:O) E15.8(C:O) E15.11(D:O) E18.8(B:!Q) E18.9(B:Q) E24.8(B:O)

### Notes on the sheet
- Unused Gates

## Sheet 5 of 5
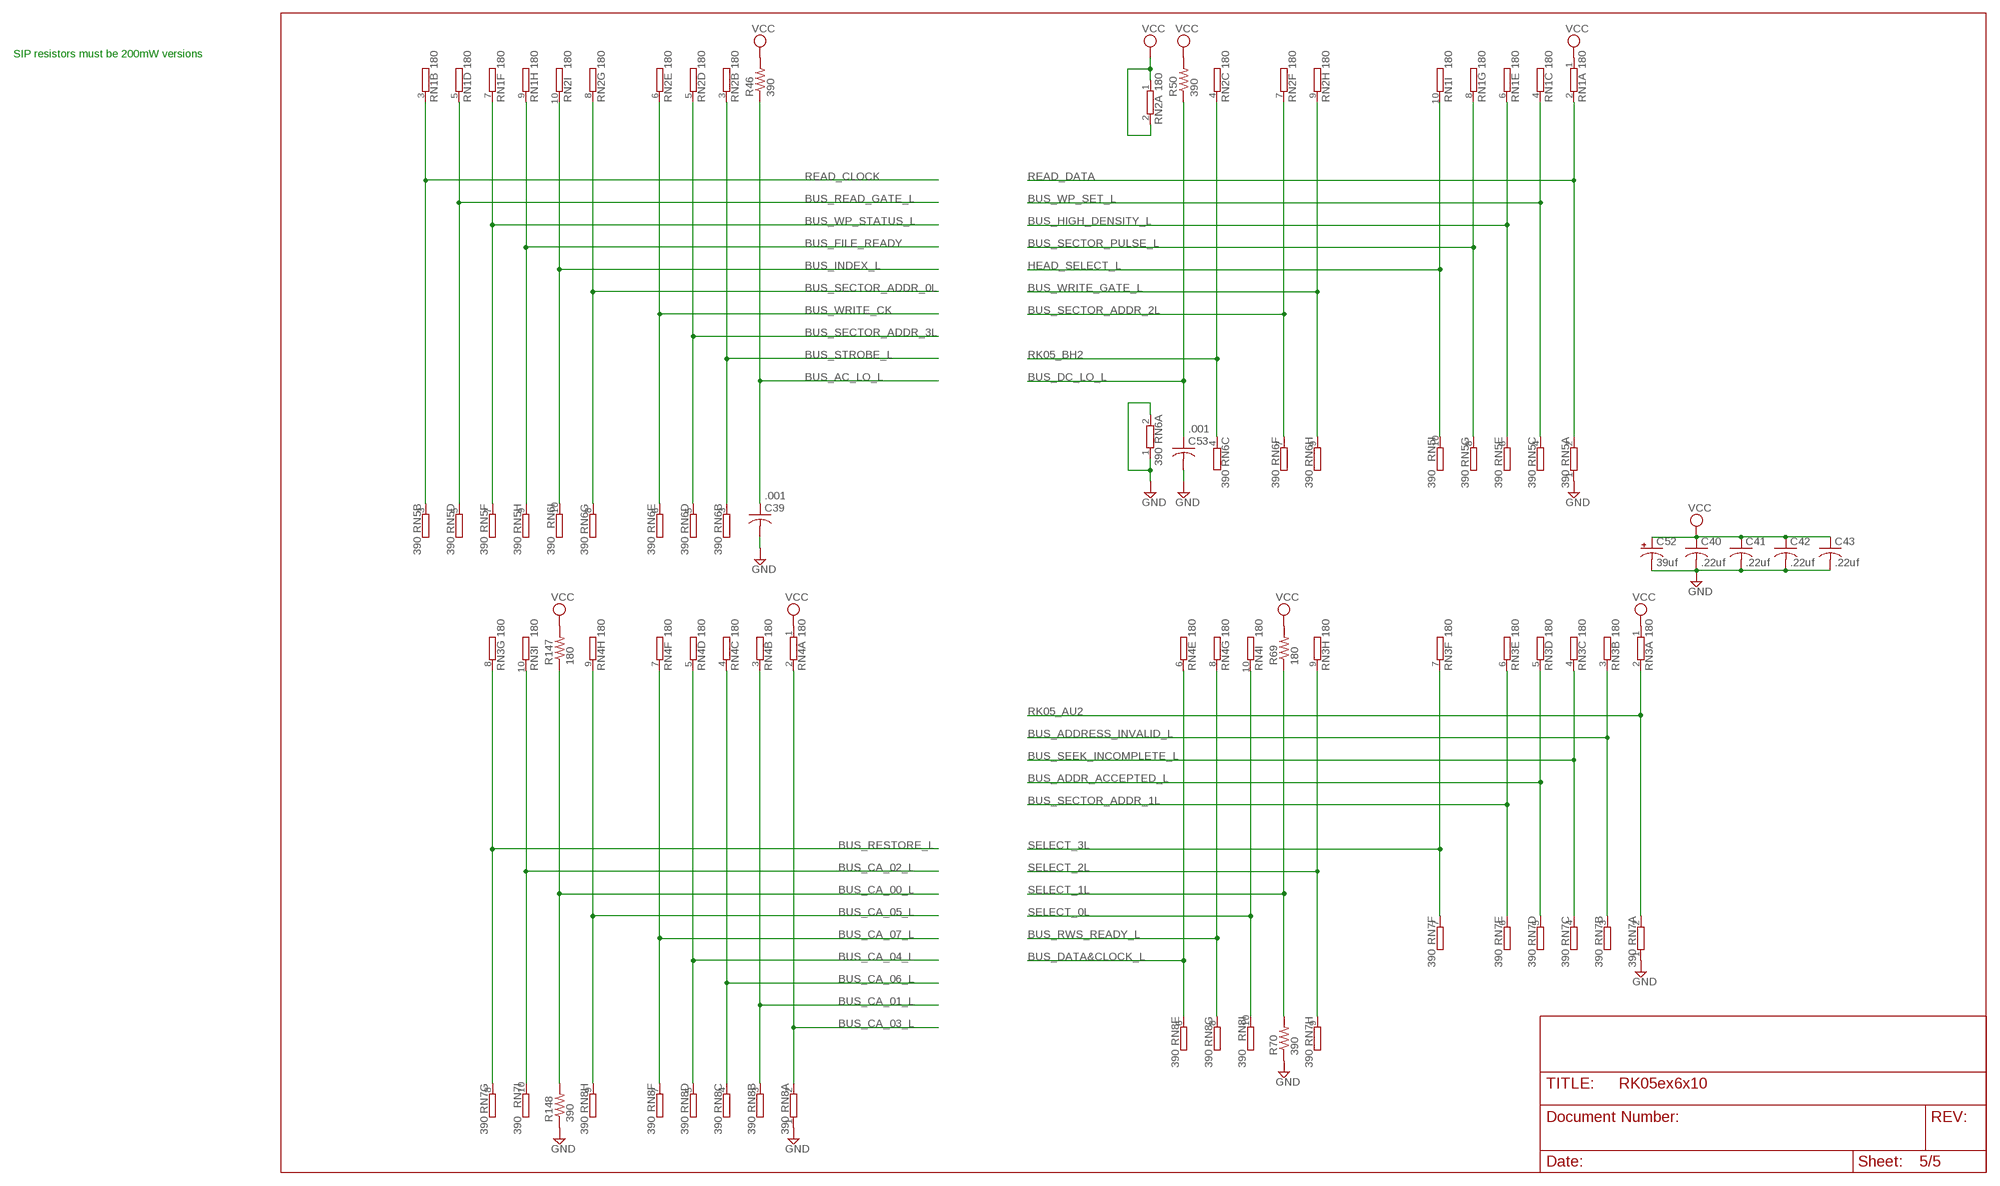
[diagram p4: schematic, sheet 5]

### Parts
C39  .001  C-US050-025X075  [C050-025X075]
C40  .22uf  C-US050-025X075  [C050-025X075]
C41  .22uf  C-US050-025X075  [C050-025X075]
C42  .22uf  C-US050-025X075  [C050-025X075]
C43  .22uf  C-US050-025X075  [C050-025X075]
C52  39uf  CPOL-USE15-5AXIAL  [E15-5]
C53  .001  C-US050-025X075  [C050-025X075]
R46  390  R-US_0207/10  [0207/10]
R50  390  R-US_0207/10  [0207/10]
R69  180  R-US_0207/10  [0207/10]
R70  390  R-US_0207/10  [0207/10]
R147  180  R-US_0207/10  [0207/10]
R148  390  R-US_0207/10  [0207/10]
RN1  180  GE09R  [SIL10]
RN2  180  GE09R  [SIL10]
RN3  180  GE09R  [SIL10]
RN4  180  GE09R  [SIL10]
RN5  390  GE09R  [SIL10]
RN6  390  GE09R  [SIL10]
RN7  390  GE09R  [SIL10]
RN8  390  GE09R  [SIL10]

### Nets
BUS_AC_LO_L: C39.1 R46.1 ; also sheet 1
BUS_ADDR_ACCEPTED_L: RN3.5 RN7.5 ; also sheet 1
BUS_ADDRESS_INVALID_L: RN3.3 RN7.3 ; also sheet 1,3
BUS_CA_00_L: R147.1 R148.2 ; also sheet 1,4
BUS_CA_01_L: RN4.3 RN8.3 ; also sheet 1,4
BUS_CA_02_L: RN3.10 RN7.10 ; also sheet 1,4
BUS_CA_03_L: RN4.2 RN8.2 ; also sheet 1,4
BUS_CA_04_L: RN4.5 RN8.5 ; also sheet 1,4
BUS_CA_05_L: RN4.9 RN8.9 ; also sheet 1,4
BUS_CA_06_L: RN4.4 RN8.4 ; also sheet 1,4
BUS_CA_07_L: RN4.7 RN8.7 ; also sheet 1,4
BUS_DATA&CLOCK_L: RN4.6 RN8.6 ; also sheet 1,2
BUS_DC_LO_L: C53.1 R50.1 ; also sheet 1
BUS_FILE_READY: RN1.9 RN5.9 ; also sheet 1
BUS_HIGH_DENSITY_L: RN1.6 RN5.6 ; also sheet 1
BUS_INDEX_L: RN2.10 RN6.10 ; also sheet 1,2
BUS_READ_GATE_L: RN1.5 RN5.5 ; also sheet 1
BUS_RESTORE_L: RN3.8 RN7.8 ; also sheet 1,3
BUS_RWS_READY_L: RN4.8 RN8.8 ; also sheet 1,3
BUS_SECTOR_ADDR_0L: RN2.8 RN6.8 ; also sheet 1,2
BUS_SECTOR_ADDR_1L: RN3.6 RN7.6 ; also sheet 1,2
BUS_SECTOR_ADDR_2L: RN2.7 RN6.7 ; also sheet 1,2
BUS_SECTOR_ADDR_3L: RN2.5 RN6.5 ; also sheet 1,2
BUS_SECTOR_PULSE_L: RN1.8 RN5.8 ; also sheet 1
BUS_SEEK_INCOMPLETE_L: RN3.4 RN7.4 ; also sheet 1,3
BUS_STROBE_L: RN2.3 RN6.3 ; also sheet 1,3
BUS_WP_SET_L: RN1.4 RN5.4 ; also sheet 1
BUS_WP_STATUS_L: RN1.7 RN5.7 ; also sheet 1
BUS_WRITE_CK: RN2.6 RN6.6 ; also sheet 1
BUS_WRITE_GATE_L: RN2.9 RN6.9 ; also sheet 1,2
GND: C39.2 C40.2 C41.2 C42.2 C43.2 C52.- C53.2 R70.1 R148.1 RN5.1 RN6.1 RN6.2 RN7.1 RN8.1 ; also sheet 1,2,3,4
HEAD_SELECT_L: RN1.10 RN5.10 ; also sheet 1
READ_CLOCK: RN1.3 RN5.3 ; also sheet 1
READ_DATA: RN1.2 RN5.2 ; also sheet 1
RK05_AU2: RN3.2 RN7.2 ; also sheet 1
RK05_BH2: RN2.4 RN6.4 ; also sheet 1
SELECT_0L: RN4.10 RN8.10 ; also sheet 1
SELECT_1L: R69.1 R70.2 ; also sheet 1
SELECT_2L: RN3.9 RN7.9 ; also sheet 1
SELECT_3L: RN3.7 RN7.7 ; also sheet 1
VCC: C40.1 C41.1 C42.1 C43.1 C52.+ R46.2 R50.2 R69.2 R147.2 RN1.1 RN2.1 RN2.2 RN3.1 RN4.1 ; also sheet 1,2,3,4

### Notes on the sheet
- SIP resistors must be 200mW versions

## Power pins joined to a net without a drawn wire
GND: E1.7(P:GND) E2.7(P:GND) E3.8(GND) E4.7(P:GND) E5.7(P:GND) E6.7(P:GND) E7.7(P:GND) E8.8(P:GND) E9.7(P:GND) E10.7(P:GND) E11.7(P:GND) E12.7(P:GND) E13.4(PWR:GND) E14.8(P:GND) E15.7(P:GND) E16.7(P:GND) E17.7(P:GND) E18.7(P:GND) E19.8(GND) E20.8(GND) E21.4(PWR:GND) E22.4(PWR:GND) E23.7(P:GND) E24.7(P:GND) E26.7(P:GND) E27.7(P:GND) E28.7(P:GND) E29.7(P:GND) E30.4(PWR:GND) E31.4(PWR:GND) E32.4(PWR:GND) E33.4(PWR:GND)
VCC: E1.14(P:VCC) E2.14(P:VCC) E3.16(VCC) E4.14(P:VCC) E5.14(P:VCC) E6.14(P:VCC) E7.14(P:VCC) E8.16(P:VCC) E9.14(P:VCC) E10.14(P:VCC) E11.14(P:VCC) E12.14(P:VCC) E13.8(PWR:VCC) E14.16(P:VCC) E15.14(P:VCC) E16.14(P:VCC) E17.14(P:VCC) E18.14(P:VCC) E19.16(VCC) E20.16(VCC) E21.8(PWR:VCC) E22.8(PWR:VCC) E23.14(P:VCC) E24.14(P:VCC) E26.14(P:VCC) E27.14(P:VCC) E28.14(P:VCC) E29.14(P:VCC) E30.8(PWR:VCC) E31.8(PWR:VCC) E32.8(PWR:VCC) E33.8(PWR:VCC)

## Library data of the parts
ADDR_INV POWER_ON SEEK_INC = dec-con:BULB: T 1 3/4 Bulb
BIT0 BIT1-BIT3 CW CYL1 CYL2 CYL4 CYL8 CYL16 CYL32 CYL64 CYL128 DC_ERASE FWD/REV HEAD RTZ RUN WRITE = switch:M9040P: TOGGLE SWITCH Marquardt
C1-C43 C53 C62 C63 = rcl:C-US: CAPACITOR, American symbol
C44 C45 C52 C60 C61 C67 C68 = rcl:CPOL-US: POLARIZED CAPACITOR, American symbol
D1-D4 = diode:1N4148: DIODE high speed (Philips)
D5 = diode:ZENER-DIODE: Z-Diode
DRIVE FUNCTION = switch:CK103X04: ROTARY SWITCH C&K
E1 E16 E23 = 74xx-us:74*10: Triple 3-input NAND gate
E2 E5 E11 E18 = 74xx-us:74*74: Dual D type positive edge triggered FLIP FLOP, preset and clear
E3 = 74xx-us:74*42: 4-line to 10-line DECODER (1-of-10)
E4 E24 = 74xx-us:74*20: Dual 4-input NAND gate
E6 E12 = 74xx-us:74*04: Hex INVERTER
E7 E10 E15 E17 E26-E29 = 74xx-us:74*00: Quad 2-input NAND gate
E8 E14 = 74xx-us:74*123: Retriggerable monostable MULTIVIBRATOR
E9 = dec-con:N8881: Quad 2-input NAND gate, open collector
E13 E21 E22 E30-E33 = dec-con:DS75451
E19 E20 = dec-con:74*193: Synchronous 4-bit UP/DOWN COUNTER
E25 = linear:*741: OP AMP
J1 J2 = dec-con:DEC40PINS: 40 pin ribbon connector for BC08, BC11 cables.
POWER = con-amp:FLOPPY-4: MATE N-LOCK Floppy / HDD conector Distributor: Bürklin 71F970
Q1 = transistor-small-signal:2N4870: UNIJUNCTION TRANSISTOR
R1-R8 R10-R46 R50 R69 R70 R147 R148 = rcl:R-US_: RESISTOR, American symbol
R9 = pot:TRIM_EU-: POTENTIOMETER
RN1-RN8 = resistor-sil:GE09R: SIL RESISTOR; OC_FARNELL: unknown; OC_NEWARK: unknown
SECTOR = switch:CK101X12: ROTARY SWITCH C&K

## Net classes
0 default: width 0.508 mm, clearance 0.279 mm